# Altium schematic sheet FLY DIVER.SchDoc
size A3
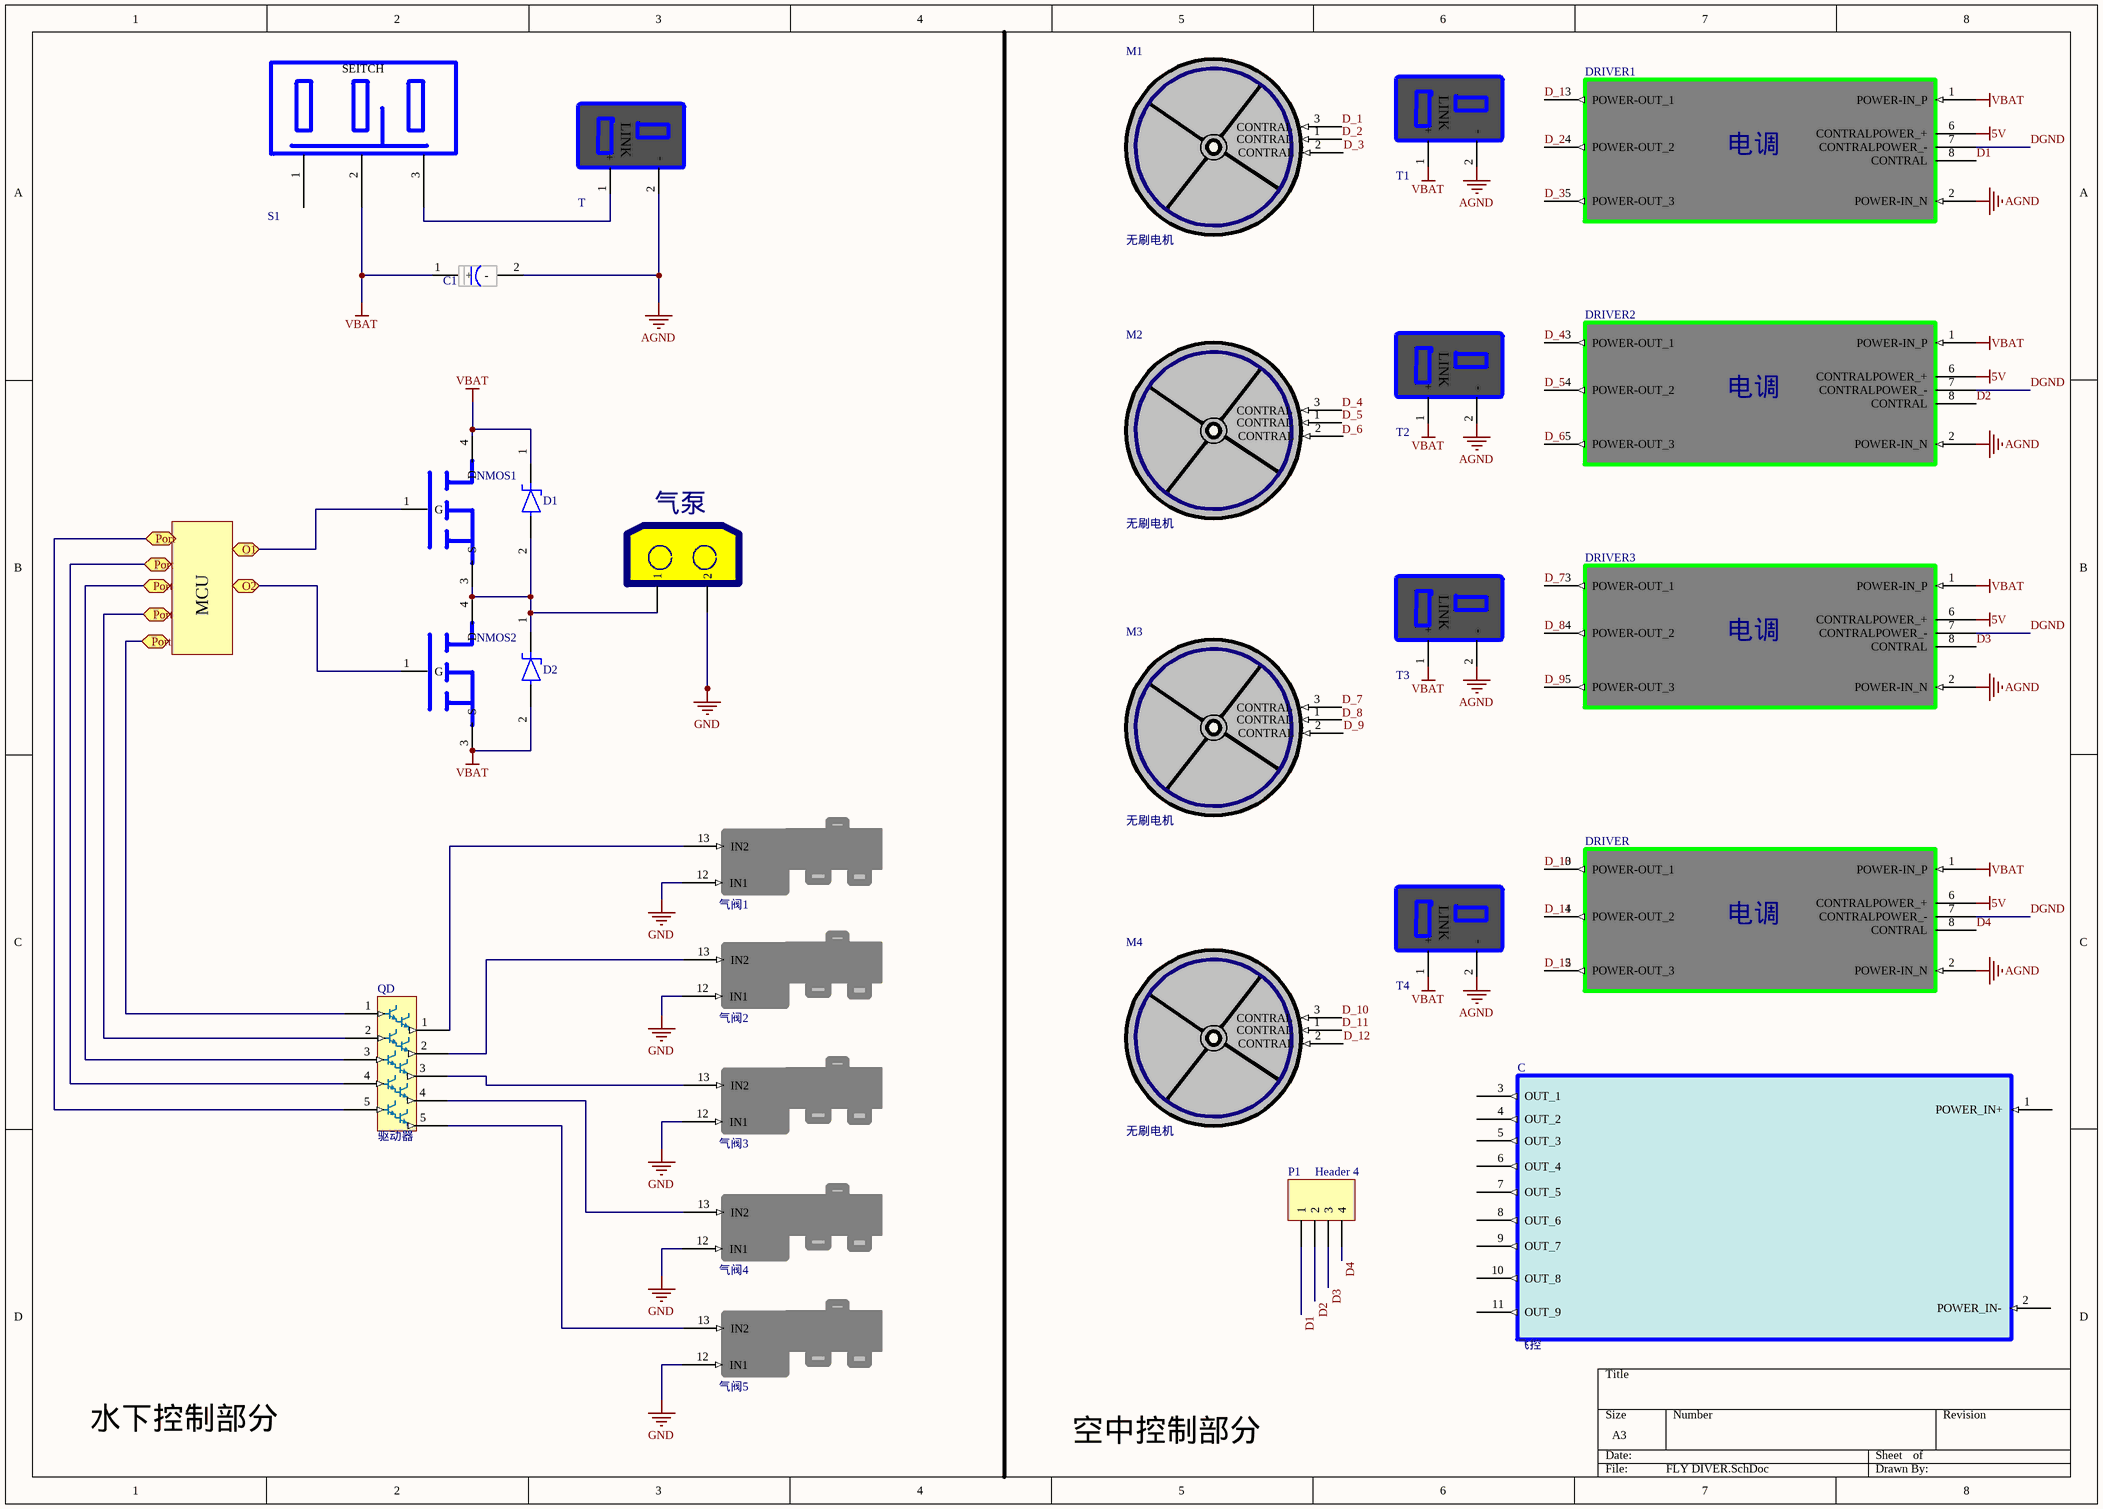
[diagram p0: FLY DIVER.SchDoc]

## Parts
*  MCU  (value not drawn)
C  飞控
C1  钽电容  [钽B]  (value not drawn)
D1  贴片二极管  [二极管SMA]  (value not drawn)
D2  贴片二极管  [二极管SMA]  (value not drawn)
DRIVER  U?  (value not drawn)
DRIVER1  U?  (value not drawn)
DRIVER2  U?  (value not drawn)
DRIVER3  U?  (value not drawn)
M1  无刷电机
M2  无刷电机
M3  无刷电机
M4  无刷电机
NMOS1  NMOS  [NMOS]  (value not drawn)
NMOS2  NMOS  [NMOS]  (value not drawn)
P1  Header 4  [HDR1X4]
Q1  气阀1
Q2  气阀2
Q3  气阀3
Q4  气阀4
Q5  气阀5
QD  驱动器
S1  拨动开关  [拨动开关]  (value not drawn)
T  T型头  [T型头]  (value not drawn)
T1  T型头  [T型头]  (value not drawn)
T2  T型头  [T型头]  (value not drawn)
T3  T型头  [T型头]  (value not drawn)
T4  T型头  [T型头]  (value not drawn)
气泵  P  [2脚接头]  (value not drawn)

## Ports
O1, O2, Port

## Nets
5V: DRIVER.6(CONTRALPOWER_+) DRIVER1.6(CONTRALPOWER_+) DRIVER2.6(CONTRALPOWER_+) DRIVER3.6(CONTRALPOWER_+)
AGND: C1.2(-) DRIVER.2(POWER-IN_N) DRIVER1.2(POWER-IN_N) DRIVER2.2(POWER-IN_N) DRIVER3.2(POWER-IN_N) T.2(-) T1.2(-) T2.2(-) T3.2(-) T4.2(-)
GND: Q1.12(IN1) Q2.12(IN1) Q3.12(IN1) Q4.12(IN1) Q5.12(IN1) 气泵.2
VBAT: C1.1(+) D1.1 D2.2 DRIVER.1(POWER-IN_P) DRIVER1.1(POWER-IN_P) DRIVER2.1(POWER-IN_P) DRIVER3.1(POWER-IN_P) NMOS1.4(D) NMOS2.3(S) S1.2 T1.1(+) T2.1(+) T3.1(+) T4.1(+)
D1: DRIVER1.8(CONTRAL) P1.1
D2: DRIVER2.8(CONTRAL) P1.2
D3: DRIVER3.8(CONTRAL) P1.3
D4: DRIVER.8(CONTRAL) P1.4
D_1: DRIVER1.3(POWER-OUT_1) M1.3(CONTRAL)
D_2: DRIVER1.4(POWER-OUT_2) M1.1(CONTRAL)
D_3: DRIVER1.5(POWER-OUT_3) M1.2(CONTRAL)
D_4: DRIVER2.3(POWER-OUT_1) M2.3(CONTRAL)
D_5: DRIVER2.4(POWER-OUT_2) M2.1(CONTRAL)
D_6: DRIVER2.5(POWER-OUT_3)
D_7: DRIVER3.3(POWER-OUT_1) M3.3(CONTRAL)
D_8: DRIVER3.4(POWER-OUT_2)
D_9: DRIVER3.5(POWER-OUT_3) M3.2(CONTRAL)
D_10: DRIVER.3(POWER-OUT_1) M4.3(CONTRAL)
D_11: DRIVER.4(POWER-OUT_2) M4.1(CONTRAL)
D_12: DRIVER.5(POWER-OUT_3) M4.2(CONTRAL)
DGND: DRIVER.7(CONTRALPOWER_-) DRIVER1.7(CONTRALPOWER_-) DRIVER2.7(CONTRALPOWER_-) DRIVER3.7(CONTRALPOWER_-)
O1: NMOS1.1(G) ; port O1
O2: NMOS2.1(G) ; port O2
Port: QD.1(IN) QD.2(IN) QD.3(IN) QD.4(IN) QD.5(IN) ; port Port
NetD1_2: D1.2 D2.1 NMOS1.3(S) NMOS2.4(D) 气泵.1
NetQ1_13: Q1.13(IN2) QD.1(OUT)
NetQ2_13: Q2.13(IN2) QD.2(OUT)
NetQ3_13: Q3.13(IN2) QD.3(OUT)
NetQ4_13: Q4.13(IN2) QD.4(OUT)
NetQ5_13: Q5.13(IN2) QD.5(OUT)
NetS1_3: S1.3 T.1(+)

Not connected (* = marked no-connect by the designer): C 1(POWER_IN+) 2(POWER_IN-) 3(OUT_1) 4(OUT_2) 5(OUT_3) 6(OUT_4) 7(OUT_5) 8(OUT_6) 9(OUT_7) 10(OUT_8) 11(OUT_9); M2 2(CONTRAL); M3 1(CONTRAL); S1 1

## Notes on the sheet
- 水下控制部分
- 空中控制部分
- Labels drawn without touching a wire or pin: D_6, D_8
- (in symbol T型头) LINK
- (in symbol 拨动开关) SEITCH

## Library data of the parts
DRIVER DRIVER1-DRIVER3 = 电调
P1 = Header 4: Header, 4-Pin; LatestRevisionDate: 17-Jul-2002; LatestRevisionNote: Re-released for DXP Platform.; Publisher: Altium Limited
Q1-Q5 = 气阀
气泵 = 2脚接头